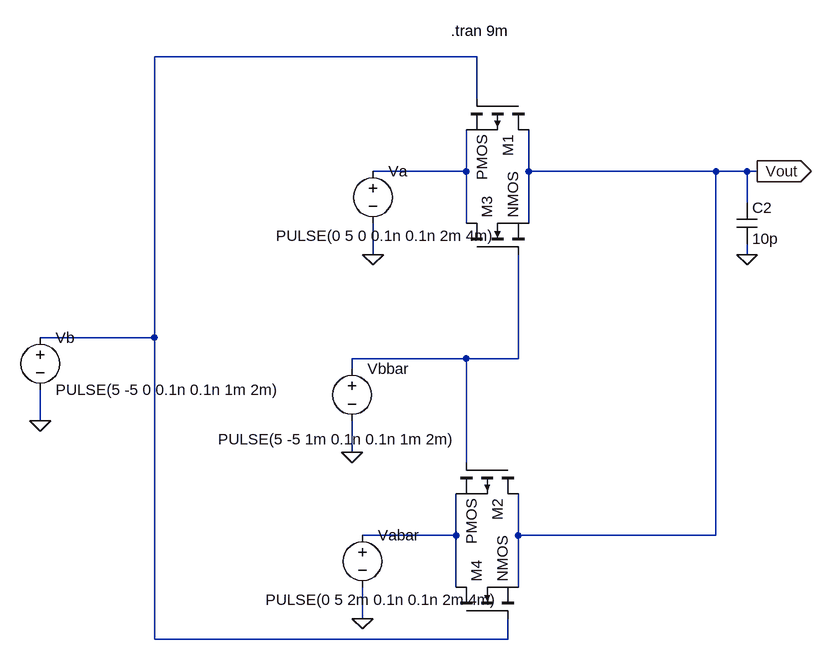
[diagram p0: schematic Exp 6 TG and EXOR using TG.asc]
Exp 6 TG and EXOR using TG.asc, the LTspice schematic file:
Version 4
SHEET 1 880 868
WIRE 224 -32 -272 -32
WIRE 224 32 224 -32
WIRE 208 144 208 80
WIRE 208 144 64 144
WIRE 304 144 304 80
WIRE 592 144 304 144
WIRE 640 144 592 144
WIRE 656 144 640 144
WIRE 640 192 640 144
WIRE 208 224 208 144
WIRE 304 224 304 144
WIRE 64 272 64 224
WIRE 640 272 640 256
WIRE -272 400 -272 -32
WIRE -272 400 -448 400
WIRE 208 432 32 432
WIRE 288 432 288 272
WIRE 288 432 208 432
WIRE 32 448 32 432
WIRE -448 528 -448 480
WIRE 32 576 32 528
WIRE 208 592 208 432
WIRE 192 704 192 640
WIRE 192 704 48 704
WIRE 288 704 288 640
WIRE 592 704 592 144
WIRE 592 704 288 704
WIRE 192 784 192 704
WIRE 288 784 288 704
WIRE 48 832 48 784
WIRE -272 864 -272 400
WIRE 272 864 272 832
WIRE 272 864 -272 864
FLAG 656 144 Vout
IOPIN 656 144 Out
FLAG 64 272 0
FLAG 32 576 0
FLAG -448 528 0
FLAG 640 272 0
FLAG 48 832 0
SYMBOL voltage 64 128 R0
WINDOW 3 -149 115 Left 2
WINDOW 123 0 0 Left 0
WINDOW 39 0 0 Left 0
SYMATTR Value PULSE(0 5 0 0.1n 0.1n 2m 4m)
SYMATTR InstName Va
SYMBOL voltage 32 432 R0
WINDOW 3 -206 124 Left 2
WINDOW 123 0 0 Left 0
WINDOW 39 0 0 Left 0
SYMATTR Value PULSE(5 -5 1m 0.1n 0.1n 1m 2m)
SYMATTR InstName Vbbar
SYMBOL cap 624 192 R0
SYMATTR InstName C2
SYMATTR Value 10p
SYMBOL voltage -448 384 R0
WINDOW 123 0 0 Left 0
WINDOW 39 0 0 Left 0
SYMATTR InstName Vb
SYMATTR Value PULSE(5 -5 0 0.1n 0.1n 1m 2m)
SYMBOL pmos 304 32 R90
SYMATTR InstName M1
SYMBOL nmos 208 272 R270
SYMATTR InstName M3
SYMBOL voltage 48 688 R0
WINDOW 3 -149 115 Left 2
WINDOW 123 0 0 Left 0
WINDOW 39 0 0 Left 0
SYMATTR Value PULSE(0 5 2m 0.1n 0.1n 2m 4m)
SYMATTR InstName Vabar
SYMBOL pmos 288 592 R90
SYMATTR InstName M2
SYMBOL nmos 192 832 R270
SYMATTR InstName M4
TEXT 184 -72 Left 2 !.tran 9m

The netlist it stands for:
* Exp 6 TG and EXOR using TG.asc
Va N002 0 PULSE(0 5 0 0.1n 0.1n 2m 4m)
Vbbar N003 0 PULSE(5 -5 1m 0.1n 0.1n 1m 2m)
C2 Vout 0 10p
Vb N001 0 PULSE(5 -5 0 0.1n 0.1n 1m 2m)
M1 Vout N001 N002 N002 PMOS
M3 N002 N003 Vout Vout NMOS
Vabar N004 0 PULSE(0 5 2m 0.1n 0.1n 2m 4m)
M2 Vout N003 N004 N004 PMOS
M4 N004 N001 Vout Vout NMOS
.model NMOS NMOS
.model PMOS PMOS
.lib standard.mos
.tran 9m
.backanno
.end